# Altium schematic sheet mod-mag.SchDoc
size A4; SheetNumber: 2
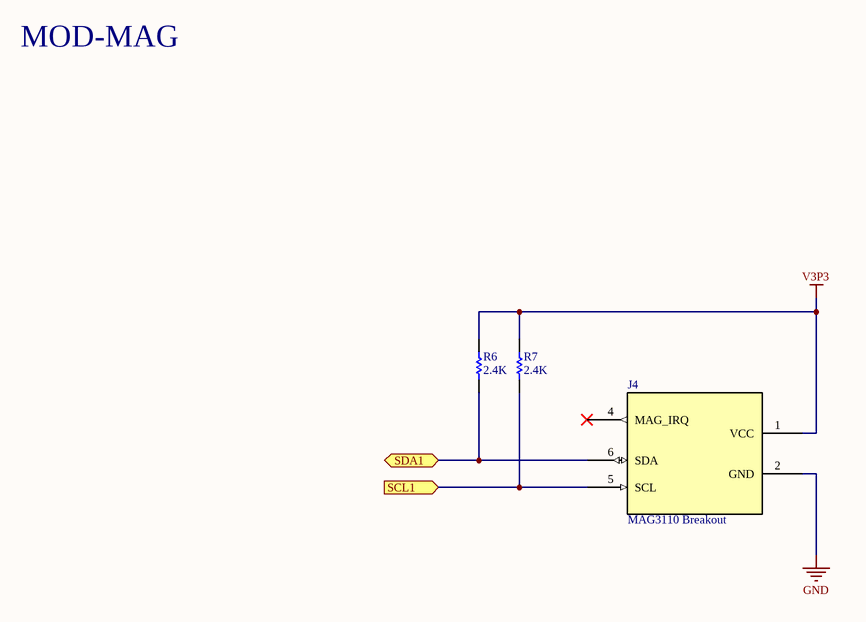
[diagram p0: mod-mag.SchDoc]

## Parts
J4  MAG3110 Breakout  [UEXT_MALE x10]
R6  2.4K  [own_0603]
R7  2.4K  [own_0603]

## Ports
SCL1 (in), SDA1 (bidir)

## Nets
GND: J4.2(GND)
V3P3: J4.1(VCC) R6.2 R7.2
SCL1: J4.5(SCL) R7.1 ; port SCL1
SDA1: J4.6(SDA) R6.1 ; port SDA1

Not connected (* = marked no-connect by the designer): J4 4(MAG_IRQ)*

## Notes on the sheet
- MOD-MAG

## Library data of the parts
J4 = MOD-MAG3110: Fournisseur: Farnell; RefFabricant: 5103310-1; Fabricant: AMP - TE Connectvity; RefFournisseur: 2452436
R6 R7 = Res1: Resistor; Value: 2K4; Fournisseur: Farnell; Fabricant: VISHAY; RefFabricant: CRCW06032K40FKEA; RefFournisseur: 1469766